# Altium project Eload Gen 3 User Interface Rev 1.PrjPcb
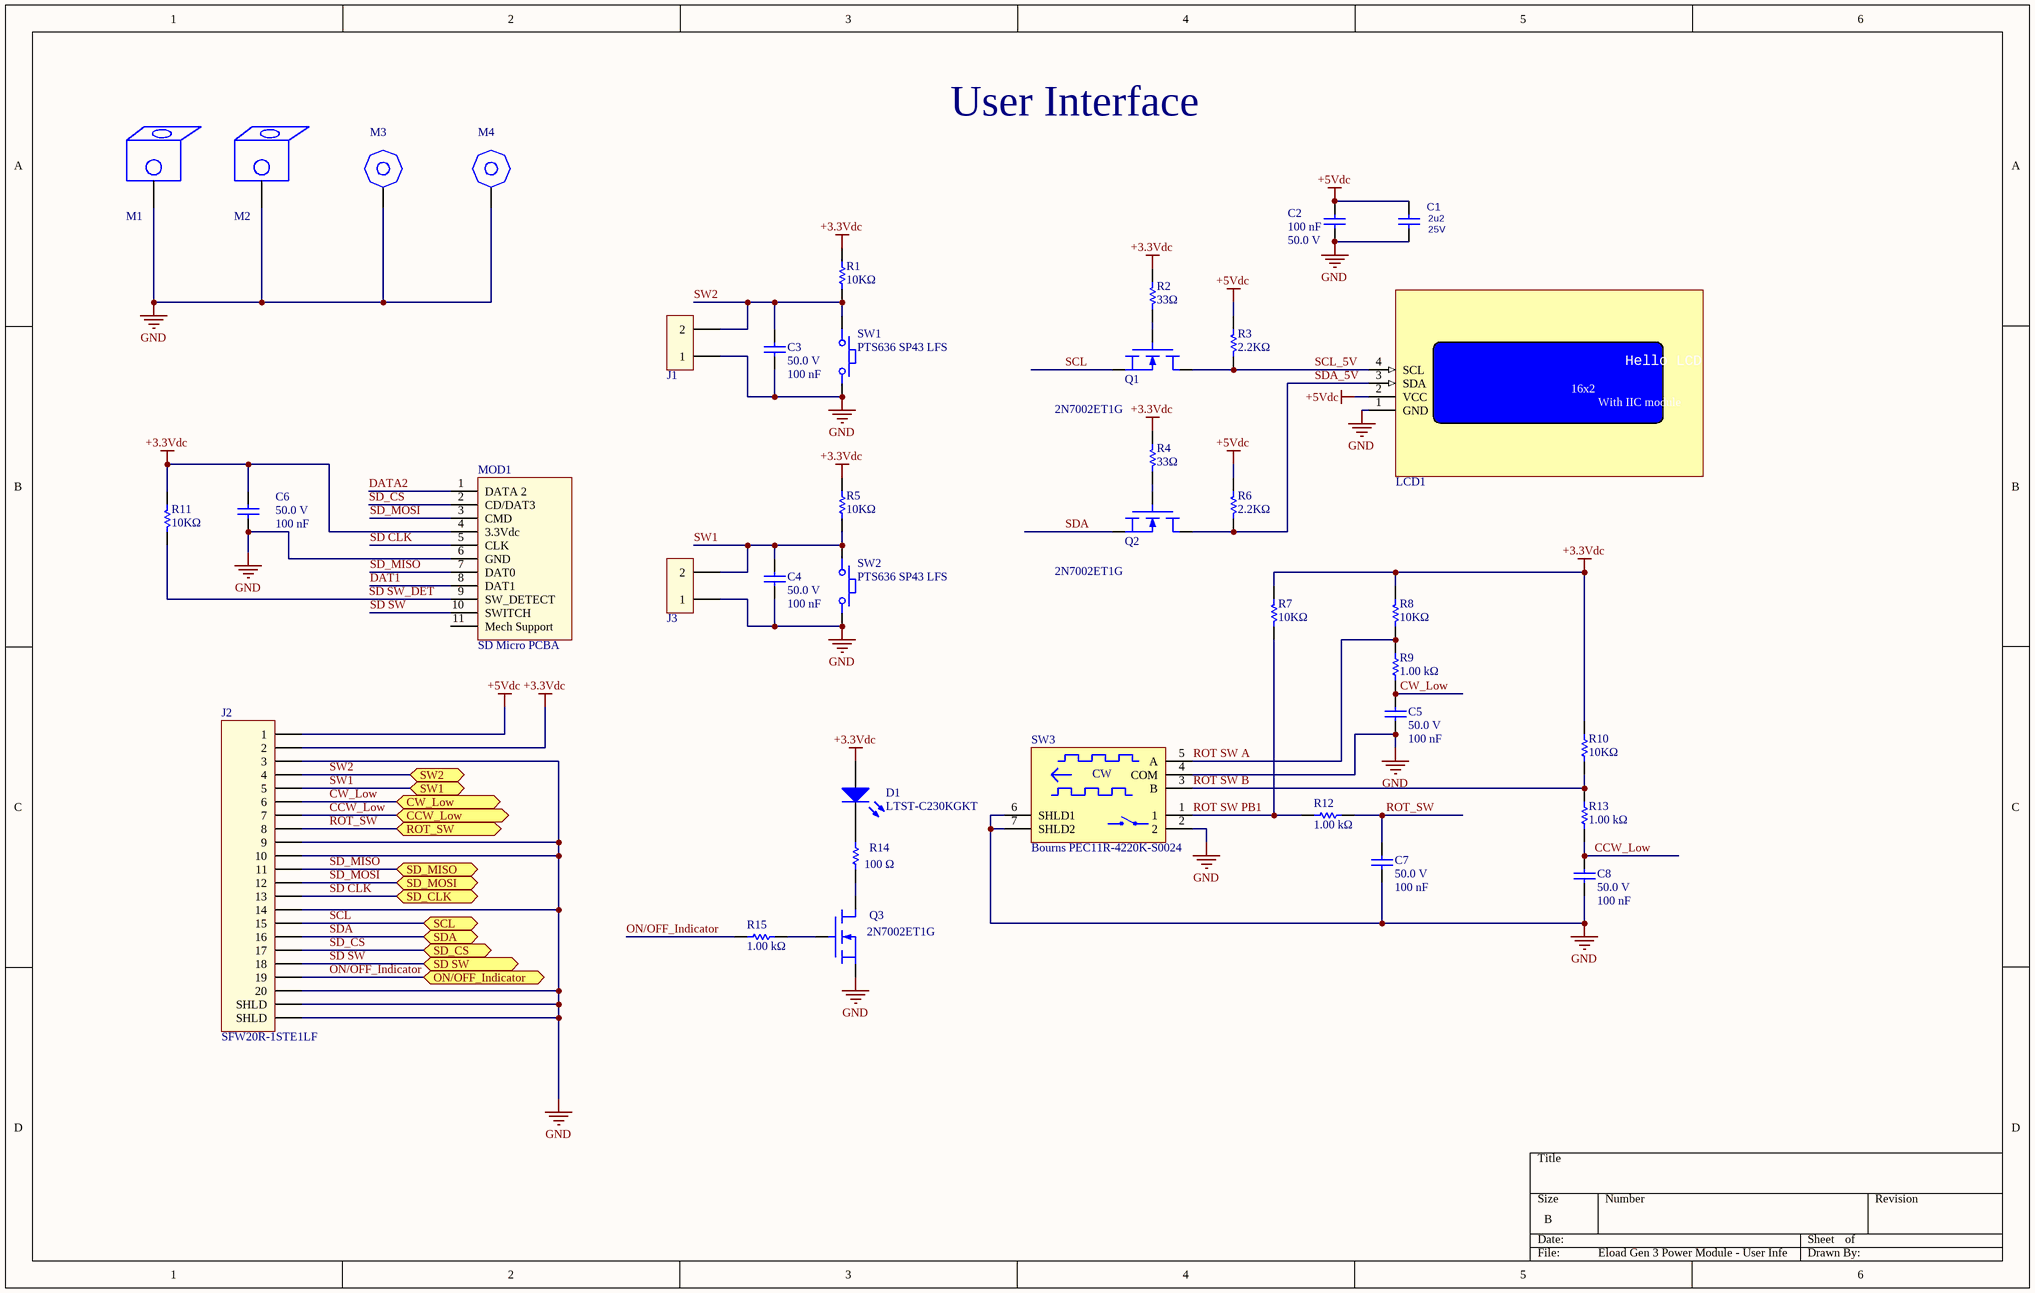
[diagram p0: Eload Gen 3 Power Module - User Inferface.SchDoc]
1 sheet, 39 parts. Net scope: flat (ports and power ports of the same name join across sheets).

## Sheet Eload Gen 3 Power Module - User Inferface.SchDoc
size B

### Parts
C1  2u2  Voltage: 25V  [CAP, 0805, HD]  (net tie)
C2  Voltage Rating (DC): 50.0 V  Capacitance: 100 nF  [Cap,0805]  (hidden comment: 08055C104JAT2A)
C3  Voltage Rating (DC): 50.0 V  Capacitance: 100 nF  [CAP, 0805, HD]  (hidden comment: 08055C104JAT2A)
C4  Voltage Rating (DC): 50.0 V  Capacitance: 100 nF  [CAP, 0805, HD]  (hidden comment: 08055C104JAT2A)
C5  Voltage Rating (DC): 50.0 V  Capacitance: 100 nF  [CAP, 0805, HD]  (hidden comment: 08055C104JAT2A)
C6  Voltage Rating (DC): 50.0 V  Capacitance: 100 nF  [Cap,0805]  (hidden comment: 08055C104JAT2A)
C7  Voltage Rating (DC): 50.0 V  Capacitance: 100 nF  [CAP, 0805, HD]  (hidden comment: 08055C104JAT2A)
C8  Voltage Rating (DC): 50.0 V  Capacitance: 100 nF  [CAP, 0805, HD]  (hidden comment: 08055C104JAT2A)
D1  LTST-C230KGKT  [LED,SMD,Bottom Entry,1206]
J1  Generic Header  [HEADER-1X2,0.1"]  (value not drawn)
J2  SFW20R-1STE1LF  [Connector,FlatFlex,20Pin,RA]
J3  Generic Header  [HEADER-1X2,0.1"]  (value not drawn)
LCD1  LCD, 20x4  [LCD Module 16x2 - IIC MOD]  (value not drawn)
M1  4334  [Mech,Bracket,RA,#6,Threaded]  (value not drawn)
M2  4334  [Mech,Bracket,RA,#6,Threaded]  (value not drawn)
M3  M3 hex Standoff  [Standoff,Hex,M3,8mm]  (value not drawn)
M4  M3 hex Standoff  [Standoff,Hex,M3,8mm]  (value not drawn)
MOD1  Discription: SD Micro PCBA  [Mod, SD Card Connector Breakout]  (hidden comment: SD Card Connector Breakout)
Q1  2N7002ET1G  [SOT23-3]
Q2  2N7002ET1G  [SOT23-3]
Q3  2N7002ET1G  [SOT23-3]
R1  Resistance: 10KΩ  [res, 0805, HD]  (hidden comment: Vishay / Dale CRCW080510K0FKTA)
R2  Resistance: 33Ω  [res, 0805, HD]  (hidden comment: CR0805-JW-330ELF)
R3  Resistance: 2.2KΩ  [res, 0805, HD]  (hidden comment: CRCW08052K20FKEA)
R4  Resistance: 33Ω  [res, 0805, HD]  (hidden comment: CR0805-JW-330ELF)
R5  Resistance: 10KΩ  [res, 0805, HD]  (hidden comment: Vishay / Dale CRCW080510K0FKTA)
R6  Resistance: 2.2KΩ  [res, 0805, HD]  (hidden comment: CRCW08052K20FKEA)
R7  Resistance: 10KΩ  [res, 0805, HD]  (hidden comment: Vishay / Dale CRCW080510K0FKTA)
R8  Resistance: 10KΩ  [res, 0805, HD]  (hidden comment: Vishay / Dale CRCW080510K0FKTA)
R9  Resistance: 1.00 kΩ  [res, 0805, HD]  (hidden comment: Vishay CRCW08051K00JNEA)
R10  Resistance: 10KΩ  [res, 0805, HD]  (hidden comment: Vishay / Dale CRCW080510K0FKTA)
R11  Resistance: 10KΩ  [res, 0805, HD]  (hidden comment: Vishay / Dale CRCW080510K0FKTA)
R12  Resistance: 1.00 kΩ  [res, 0805, HD]  (hidden comment: Vishay CRCW08051K00JNEA)
R13  Resistance: 1.00 kΩ  [res, 0805, HD]  (hidden comment: Vishay CRCW08051K00JNEA)
R14  Resistance: 100 Ω  [res, 0805, HD]  (hidden comment: CRCW0805100RJNEAC)
R15  Resistance: 1.00 kΩ  [res, 0805, HD]  (hidden comment: Vishay CRCW08051K00JNEA)
SW1  PTS636 SP43 LFS  [PTS636 SP43 LFS]
SW2  PTS636 SP43 LFS  [PTS636 SP43 LFS]
SW3  Bourns PEC11R-4220K-S0024  [Rotary encoder]

### Ports
CCW_Low, CW_Low, ON/OFF_Indicator, ROT_SW, SCL, SD SW, SD_CLK, SD_CS, SD_MISO, SD_MOSI, SDA, SW1, SW2

### Nets
+3.3Vdc: C6.2 D1.2(A) J2.2 MOD1.4(3.3Vdc) R1.1 R2.1 R4.1 R5.1 R7.2 R8.2 R10.1 R11.1
+5Vdc: C1.2 C2.2 J2.1 LCD1.2(VCC) R3.2 R6.2
GND: C1.1 C2.1 C3.1 C4.1 C5.1 C6.1 C7.1 C8.1 J1.1 J2.3 J2.9 J2.10 J2.14 J2.20 J2.21(SHLD) J2.22(SHLD) J3.1 LCD1.1(GND) M1.1 M2.1 M3.0 M4.0 MOD1.6(GND) Q3.2(S) SW1.2 SW2.2 SW3.2 SW3.4(COM) SW3.6(SHLD1) SW3.7(SHLD2)
CCW_Low: C8.2 J2.7 R13.2 ; port CCW_Low
CW_Low: C5.2 J2.6 R9.2 ; port CW_Low
DAT1: MOD1.8(DAT1)
DATA2: MOD1.1(DATA_2)
ON/OFF_Indicator: J2.19 R15.1 ; port ON/OFF_Indicator
ROT SW A: R8.1 R9.1 SW3.5(A)
ROT SW B: R10.2 R13.1 SW3.3(B)
ROT SW PB1: R7.1 R12.1 SW3.1
ROT_SW: C7.2 J2.8 R12.2 ; port ROT_SW
SCL: J2.15 Q1.2(S) ; port SCL
SCL_5V: LCD1.4(SCL) Q1.3(D) R3.1
SD CLK: J2.13 MOD1.5(CLK) ; port SD_CLK
SD SW: J2.18 MOD1.10(SWITCH) ; port SD SW
SD SW_DET: MOD1.9(SW_DETECT) R11.2
SD_CS: J2.17 MOD1.2(CD/DAT3) ; port SD_CS
SD_MISO: J2.11 MOD1.7(DAT0) ; port SD_MISO
SD_MOSI: J2.12 MOD1.3(CMD) ; port SD_MOSI
SDA: J2.16 Q2.2(S) ; port SDA
SDA_5V: LCD1.3(SDA) Q2.3(D) R6.1
SW1: C4.2 J2.5 J3.2 R5.2 SW2.1 ; port SW1
SW2: C3.2 J1.2 J2.4 R1.2 SW1.1 ; port SW2
NetD1_1: D1.1(K) R14.2
NetQ1_1: Q1.1(G) R2.2
NetQ2_1: Q2.1(G) R4.2
NetQ3_1: Q3.1(G) R15.2
NetQ3_3: Q3.3(D) R14.1

Not connected (* = marked no-connect by the designer): MOD1 11(Mech_Support)

### Notes on the sheet
- User Interface
- (in symbol LCD, 16x2, IIC) Hello LCD World; 16x2; With IIC module
- (in symbol Rotary encoder, PEC11R-4220K-S0024) CW

### Library data of the parts
C1 = Cap,0805,2.2uF,10%,25V: Cap,SMD,MLCC,2.2uF 25V X7R 10%,0805; Manufacturer: Murata; Manufacturer P/N: GRM21BR71E225KA73L (t&r, 3Kpcs); P/N: 211-121-19; iPS: 951-22501-R1; Not Stuffed: N/S; Temperature Category: -55~125 degC.; Fast Supplier: Digi-Key; Fast Supplier P/N: 490-3331-1-ND; Type: X7R
C2-C8 = Cap,0805,100nf,50V,5%,08055C104JAT2A: Capacitor; Ceramic; Cap 0.1 uF; Tol 5%; Vol-Rtg 50 VDC; SMT; 0805; X7R; Tape & Reel; Lead-Free Status: Lead Free; Case/Package (SI): 2012; Insulation Resistance: 100 GΩ; Detailed Description: 0.1µF ±5% 50V Ceramic Capacitor X7R 0805 (2012 Metric); Mounting Style: Surface Mount; Packaging: Tape & Reel (TR), Cut Tape (CT); RoHS: Compliant; Size-Width: 1.24 mm; Case/Package: 0805; Number of Pins: 2; digikey url: http://www.digikey.ca/product-detail/en/avx-corporation/08055C104JAT2A/478-3352-1-ND/930144; REACH SVHC Compliance: No SVHC; Dielectric Characteristic: X7R; Capacitance Tolerance: ±5%; Size-Length: 2.01 mm; Size-Height: 710 µm; Size-Thickness: 940 µm; Manufacturer Part Number: 08055C104JAT2A; Octopart URL: http://octopart.com/08055c104jat2a-avx-55388010; Operating Temperature: -55°C ~ 125°C; Supplier 1: Digi-Key; Supplier Part Number 1: 478-3352-1-ND
D1 = LED,1206,Green,SMD,BtmEnt,LTST-C230KGKT: LED GREEN CLEAR CHIP SMD; Manufacturer: Lite-On Inc.; Wavelength - Dominant: 571nm; Detailed Description: Green 571nm LED Indication - Discrete 2V 1206 (3216 Metric); Categories: Optoelectronics   LED Indication - Discrete; Configuration: Standard; Lens Color: Colorless; Millicandela Rating: 35mcd; Lens Style: Rectangle with Flat Top; Lens Size: 1.50mm x 1.60mm; Voltage - Forward (Vf) (Typ): 2V; Current - Test: 20mA; Viewing Angle: 130°; Wavelength - Peak: 574nm; mfg P/N: LTST-C230KGKT; Size / Dimension: 3.20mm L x 1.60mm W; Supplier 1: Digi-Key; Supplier Part Number 1: 160-1456-1-ND; Part Status: Active; Color: Green; Lens Transparency: Clear; Mounting Type: Surface Mount, Bottom Entry; Package / Case: 1206 (3216 Metric); Supplier Device Package: Chip LED; Height (Max): 1.10mm
J1 J3 = Header 1x2,0.1"Spacing
J2 = Connector,FFC,SMD,20Pin,1mmSpc,SFW20R-1STE1LF: CONN FFC BOTTOM 20POS 1.00MM R/A; Manufacturer: Amphenol ICC (FCI); Detailed Description: 20 Position FFC, FPC Connector Contacts, Bottom 0.039" (1.00mm) Surface Mount, Right Angle; Categories: Connectors, Interconnects   FFC, FPC (Flat Flexible) Connectors; Flat Flex Type: FFC, FPC; Connector/Contact Type: Contacts, Bottom; Number of Positions: 20; Pitch: 0.039" (1.00mm); FFC, FCB Thickness: 0.30mm, 0.33mm; Locking Feature: Slide Lock; Cable End Type: Straight, Tapered; Actuator Material: Polyphenylene Sulfide (PPS), Glass Filled; Voltage Rating: 100V; Material Flammability Rating: UL94 V-0; Current Rating (Amps): 1A; Actuator Color: Black; mfg P/N: SFW20R-1STE1LF; Mounting Type: Surface Mount, Right Angle; Termination: Solder; Height Above Board: 0.106" (2.70mm); Contact Material: Phosphor Bronze; Contact Finish: Tin; Housing Material: Polyphenylene Sulfide (PPS), Glass Filled; Features: Zero Insertion Force (ZIF); Operating Temperature: -55°C ~ 105°C; Housing Color: Brown; Mating Cycles: 20; Supplier 1: Digi-Key; Supplier Part Number 1: 609-1913-6-ND
LCD1 = LCD, 16x2, IIC: LCD Character Display; 4x20 Char.; 98x60; STN- BLUE; Transmissive; 8-Bit Parallel; Supplier 1: Digi-Key
M1 M2 = Mech,Bracket,RA,Threaded,4334: Mounting Bracket Short L #6-32 (2) Steel, Nickel Plated; Manufacturer: Keystone Electronics; Thread/Screw/Hole: Size #6-32 (2); mfg P/N: 4334; Type: Bracket, Threaded Hole(s); Material: Steel, Nickel Plated; Supplier 1: Digi-Key; Supplier Part Number 1: 36-4334-ND; Supplier 2: Digi-Key; Supplier Part Number 2: 4334K-ND
M3 M4 = Mech,Standoff, M3, Hex: HEX STANDOFF M3,generic; Supplier 1: Digi-Key; Supplier Part Number 1: 36-24314-ND
MOD1 = Mod,SD Card breakout, Vertical
Q1-Q3 = MOSFET,N-Channel,SOT23,0.25A,60V,2N7002ET1G: Small Signal MOSFET, 60 V, 310 mA, Single, N-Channel, 3-Pin SOT-23, Pb-Free, Tape and Reel; Manufacturer: ON Semiconductor; Continuous Drain Current (Ids): 0.25A; Lead-Free Status: Lead Free; Drain to Source Voltage (Vds): 60.0 V; Power Dissipation (Max): 350mW (Ta); REACH SVHC Compliance: No SVHC; Number of Pins: 3; Halogen Free Status: Halogen Free; Case/Package: SOT-23-3; Polarity: N-Channel; RoHS: Compliant; Lifecycle Status: Active; Manufacturer Part Number: 2N7002ET1G; Supplier 1: Digi-Key; Supplier Part Number 1: 2N7002ET1GOSCT-ND; Supplier 2: LCSC; Supplier Part Number 2: C71533
R1 R5 R7 R8 R10 R11 = Res,0805,10.0kΩ,1%,100 ppm,CRCW080510K0FKTA: RES SMD 10K OHM 1% 1/8W 0805; Temperature Coefficient: 100.0 ppm/C; Lead-Free Status: Contains Lead; Voltage Rating (DC): 150.0 V; Power Rating: 0.125 W; Case/Package (SI): 2012; Size-Width: 0.00125 m; Resistance Tolerance: 1%; Size-Length: 0.002 m; RoHS: Non-Compliant; Power Dissipation: 0.125 W; Number of Pins: 2; REACH SVHC Compliance: No SVHC; Size-Height: 0.00045 m; Case/Package: 0805; Mounting Style: Surface Mount; Supplier 1: Digi-Key; Supplier Part Number 1: 541-3016-1-ND
R2 R4 = Res,0805,33Ω,±5%,200ppm,CR0805-JW-330ELF: RES SMD 33 OHM 5% 1/8W 0805; Manufacturer: Bourns Inc.; Detailed Description: 33 Ohms ±5% 0.125W, 1/8W Chip Resistor 0805 (2012 Metric) Moisture Resistant Thick Film; Categories: Resistors   Chip Resistor - Surface Mount; Power (Watts): 0.125W, 1/8W; Temperature Coefficient: ±200ppm/°C; mfg P/N: CR0805-JW-330ELF; Series: CR0805; Part Status: Active; Tolerance: ±5%; Composition: Thick Film; Features: Moisture Resistant; Operating Temperature: -55°C ~ 155°C; Package / Case: 0805 (2012 Metric); Supplier Device Package: 0805; Size / Dimension: 0.079" L x 0.049" W (2.00mm x 1.25mm); Height - Seated (Max): 0.024" (0.60mm); Number of Terminations: 2; Base Part Number: CR0805; Supplier 1: Digi-Key; Supplier Part Number 1: 118-CR0805-JW-330ELFCT-ND
R3 R6 = Res,0805,2.2KΩ,±1%,100.0 ppm/°C,150.0 V,CRCW08052K20FKEA: RES SMD 2.2K OHM 1% 1/8W 0805; Case/Package (SI): 2012; Lead-Free Status: Lead Free; Power Rating: 0.125 W; Voltage Rating (DC): 150.0 V; Case/Package: 0805; Mounting Style: Surface Mount; Number of Pins: 2; REACH SVHC Compliance: No SVHC; Resistance Tolerance: ±1%; RoHS: Compliant; Size-Height: 0.00045 m; Size-Length: 0.002 m; Size-Width: 0.00125 m; Temperature Coefficient: 100.0 ppm/°C; mfg P/N: CRCW08052K20FKEA; Supplier 1: Digi-Key; Supplier Part Number 1: 541-2.20KCCT-ND
R9 R12 R13 R15 = Res,0805,1.00 kΩ,5%,200ppm,CRCW08051K00JNEA: Res Thick Film 0805 1K Ohm 5% 0.125W(1/8W) ±200ppm/C Molded SMD Automotive Paper T/R; Power Rating: 125 mW; Case/Package (SI): 2012; Lead-Free Status: Lead Free; Temperature Coefficient: 200 ppm/°C; Voltage Rating (DC): 150 V; Size-Width: 1.25 mm; Mounting Style: Surface Mount; REACH SVHC Compliance: No SVHC; Manufacturer Part Number: CRCW08051K00JNEA; Number of Pins: 2; Size-Height: 450 µm; Packaging: Tape & Reel (TR), Cut Tape (CT); RoHS: Compliant; Resistance Tolerance: ±5%; Case/Package: 0805; Size-Length: 2.00 mm; Supplier 1: Digi-Key; Supplier Part Number 1: 541-1.0KADKR-ND
R14 = Res,0805,100Ω,5%,±200ppm/°C: RES 100 OHM 5% 1/8W 0805; Lead-Free Status: Lead Free; Power Rating: 0.125 W; Detailed Description: 100 Ohms ±5% 0.125W, 1/8W Chip Resistor 0805 (2012 Metric) Thick Film; Case/Package: 0805 (2012 Metric); Number of Pins: 2; RoHS: Compliant; mfg P/N: CRCW0805100RJNEAC; Tolerance: ±5%; Temperature Coefficient: ±200ppm/°C; Operating Temperature: -55°C ~ 155°C; Supplier 1: Digi-Key; Supplier Part Number 1: 541-100ACT-ND
SW1 SW2 = Switch,Through Hole,Tactile,SPST-NO,PTS636 SP43 LFS: Tactile Switch SPST-NO Top Actuated Through Hole; Manufacturer: C&K; Categories: Switches   Tactile Switches; Switch Function: Off-Mom; Contact Rating @ Voltage: 0.05A @ 12VDC; Actuator Type: Rectangular Button; Actuator Height off PCB, Vertical: 4.30mm; Outline: 6.00mm x 3.50mm; Illumination: Non-Illuminated; Operating Force: 320gf; Ingress Protection: IP40; Switch Travel: 0.30mm; Mechanical Life: 20,000 Cycles; mfg P/N: PTS636 SP43 LFS; Detailed Description: Tactile Switch SPST-NO Top Actuated Through Hole; Series: PTS636; Part Status: Active; Circuit: SPST-NO; Mounting Type: Through Hole; Actuator Orientation: Top Actuated; Termination Style: PC Pin; Operating Temperature: -20°C ~ 70°C; Supplier 1: Digi-Key; Supplier Part Number 1: CKN12304-ND
SW3 = Rotary encoder, PEC11R-4220K-S0024: 24 Pulse Incremental Mechanical Rotary Encoder w/ 6 mm Knurl Shaft, Through Hole; Size-Width: 12.5 mm; RoHS: Compliant; Supplier 1: Digi-Key; Supplier Part Number 1: PEC11R-4020K-S0024-ND